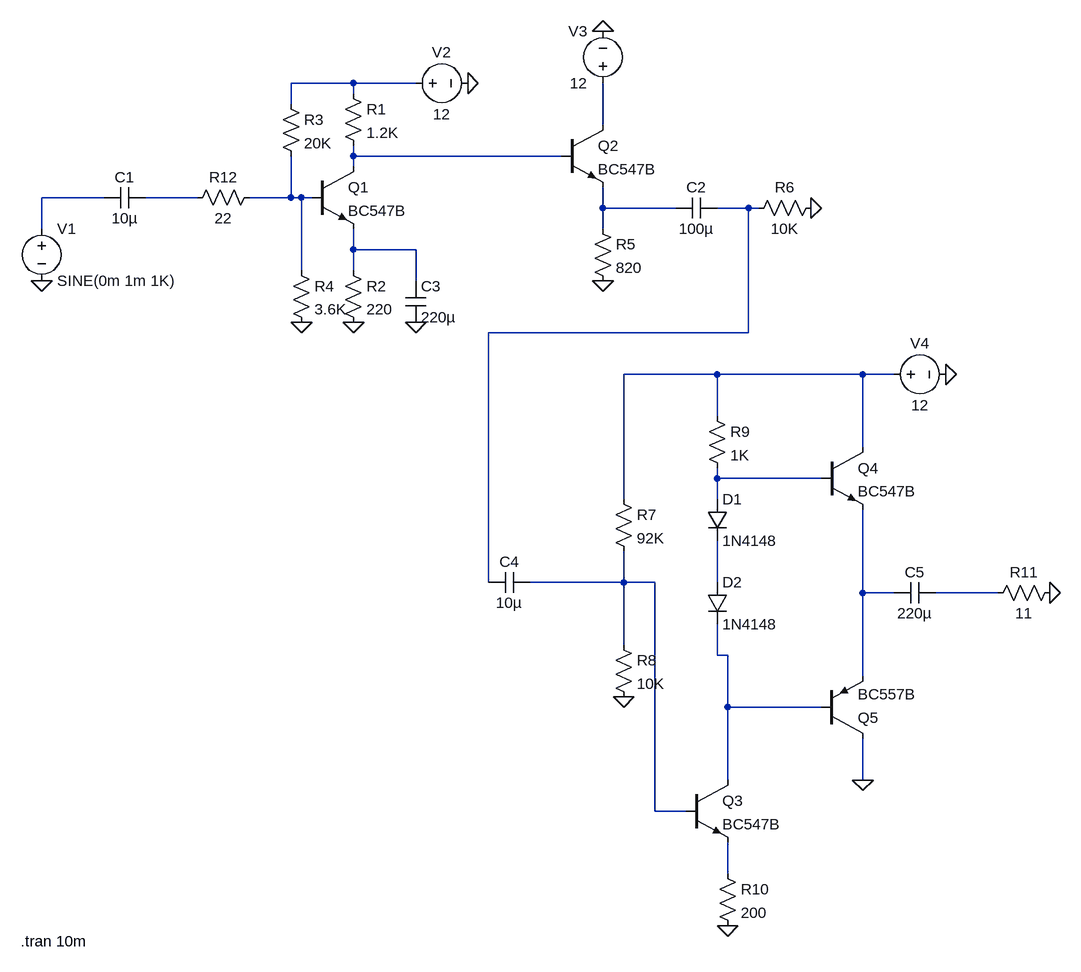
[diagram p0: schematic microphone_amplifier_with_classAB_driver.asc]
microphone_amplifier_with_classAB_driver.asc, the LTspice schematic file:
Version 4.1
SHEET 1 1316 1304
WIRE 224 -32 128 -32
WIRE 320 -32 224 -32
WIRE 224 -16 224 -32
WIRE 128 0 128 -32
WIRE 608 32 608 -32
WIRE 224 80 224 64
WIRE 544 80 224 80
WIRE 224 96 224 80
WIRE -160 144 -256 144
WIRE -16 144 -96 144
WIRE 128 144 128 80
WIRE 128 144 64 144
WIRE 144 144 128 144
WIRE 160 144 144 144
WIRE 608 160 608 128
WIRE 720 160 608 160
WIRE 832 160 784 160
WIRE 848 160 832 160
WIRE -256 192 -256 144
WIRE 608 192 608 160
WIRE 224 224 224 192
WIRE 320 224 224 224
WIRE 144 256 144 144
WIRE 224 256 224 224
WIRE 320 272 320 224
WIRE 832 352 832 160
WIRE 832 352 432 352
WIRE 784 416 640 416
WIRE 1008 416 784 416
WIRE 1056 416 1008 416
WIRE 784 480 784 416
WIRE 1008 528 1008 416
WIRE 784 576 784 560
WIRE 944 576 784 576
WIRE 640 608 640 416
WIRE 784 608 784 576
WIRE 432 736 432 352
WIRE 640 736 640 688
WIRE 640 736 496 736
WIRE 688 736 640 736
WIRE 784 736 784 672
WIRE 1008 752 1008 624
WIRE 1056 752 1008 752
WIRE 1216 752 1120 752
WIRE 640 832 640 736
WIRE 784 848 784 800
WIRE 800 848 784 848
WIRE 1008 880 1008 752
WIRE 800 928 800 848
WIRE 944 928 800 928
WIRE 800 1040 800 928
WIRE 1008 1040 1008 976
WIRE 688 1088 688 736
WIRE 736 1088 688 1088
WIRE 800 1184 800 1136
FLAG 400 -32 0
FLAG 144 336 0
FLAG 224 336 0
FLAG 320 336 0
FLAG 608 -112 0
FLAG 608 272 0
FLAG 928 160 0
FLAG 640 912 0
FLAG 800 1264 0
FLAG 1296 752 0
FLAG 1008 1040 0
FLAG 1136 416 0
FLAG -256 272 0
SYMBOL npn 160 96 R0
SYMATTR InstName Q1
SYMATTR Value BC547B
SYMBOL res 208 -32 R0
SYMATTR InstName R1
SYMATTR Value 1.2K
SYMBOL res 208 240 R0
SYMATTR InstName R2
SYMATTR Value 220
SYMBOL res 112 -16 R0
SYMATTR InstName R3
SYMATTR Value 20K
SYMBOL res 128 240 R0
SYMATTR InstName R4
SYMATTR Value 3.6K
SYMBOL voltage 304 -32 R270
WINDOW 0 32 56 VTop 2
WINDOW 3 -32 56 VBottom 2
WINDOW 123 0 0 Left 0
WINDOW 39 0 0 Left 0
SYMATTR InstName V2
SYMATTR Value 12
SYMBOL cap 304 272 R0
SYMATTR InstName C3
SYMATTR Value 220µ
SYMBOL npn 544 32 R0
SYMATTR InstName Q2
SYMATTR Value BC547B
SYMBOL voltage 608 -16 R180
WINDOW 0 24 96 Left 2
WINDOW 3 24 16 Left 2
WINDOW 123 0 0 Left 0
WINDOW 39 0 0 Left 0
SYMATTR InstName V3
SYMATTR Value 12
SYMBOL res 592 176 R0
SYMATTR InstName R5
SYMATTR Value 820
SYMBOL cap 784 144 R90
WINDOW 0 0 32 VBottom 2
WINDOW 3 32 32 VTop 2
SYMATTR InstName C2
SYMATTR Value 100µ
SYMBOL res 944 144 R90
WINDOW 0 0 56 VBottom 2
WINDOW 3 32 56 VTop 2
SYMATTR InstName R6
SYMATTR Value 10K
SYMBOL cap 496 720 R90
WINDOW 0 0 32 VBottom 2
WINDOW 3 32 32 VTop 2
SYMATTR InstName C4
SYMATTR Value 10µ
SYMBOL res 624 592 R0
SYMATTR InstName R7
SYMATTR Value 92K
SYMBOL res 624 816 R0
SYMATTR InstName R8
SYMATTR Value 10K
SYMBOL res 768 464 R0
SYMATTR InstName R9
SYMATTR Value 1K
SYMBOL diode 768 608 R0
SYMATTR InstName D1
SYMATTR Value 1N4148
SYMBOL diode 768 736 R0
SYMATTR InstName D2
SYMATTR Value 1N4148
SYMBOL npn 736 1040 R0
SYMATTR InstName Q3
SYMATTR Value BC547B
SYMBOL res 784 1168 R0
SYMATTR InstName R10
SYMATTR Value 200
SYMBOL npn 944 528 R0
SYMATTR InstName Q4
SYMATTR Value BC547B
SYMBOL pnp 944 976 M180
SYMATTR InstName Q5
SYMATTR Value BC557B
SYMBOL cap 1120 736 R90
WINDOW 0 0 32 VBottom 2
WINDOW 3 32 32 VTop 2
SYMATTR InstName C5
SYMATTR Value 220µ
SYMBOL res 1312 736 R90
WINDOW 0 0 56 VBottom 2
WINDOW 3 32 56 VTop 2
SYMATTR InstName R11
SYMATTR Value 11
SYMBOL voltage 1040 416 R270
WINDOW 0 32 56 VTop 2
WINDOW 3 -32 56 VBottom 2
WINDOW 123 0 0 Left 0
WINDOW 39 0 0 Left 0
SYMATTR InstName V4
SYMATTR Value 12
SYMBOL res 80 128 R90
WINDOW 0 0 56 VBottom 2
WINDOW 3 32 56 VTop 2
SYMATTR InstName R12
SYMATTR Value 22
SYMBOL cap -96 128 R90
WINDOW 0 0 32 VBottom 2
WINDOW 3 32 32 VTop 2
SYMATTR InstName C1
SYMATTR Value 10µ
SYMBOL voltage -256 176 R0
WINDOW 123 0 0 Left 0
WINDOW 39 0 0 Left 0
SYMATTR InstName V1
SYMATTR Value SINE(0m 1m 1K)
TEXT -288 1288 Left 2 !.tran 10m

The netlist it stands for:
* microphone_amplifier_with_classAB_driver.asc
Q1 N003 N006 N009 0 BC547B
R1 N001 N003 1.2K
R2 N009 0 220
R3 N001 N006 20K
R4 N006 0 3.6K
V2 N001 0 12
C3 N009 0 220µ
Q2 N002 N003 N007 0 BC547B
V3 N002 0 12
R5 N007 0 820
C2 N008 N007 100µ
R6 0 N008 10K
C4 N012 N008 10µ
R7 N010 N012 92K
R8 N012 0 10K
R9 N010 N011 1K
D1 N011 N013 1N4148
D2 N013 N016 1N4148
Q3 N016 N012 N017 0 BC547B
R10 N017 0 200
Q4 N010 N011 N014 0 BC547B
Q5 0 N016 N014 0 BC557B
C5 N015 N014 220µ
R11 0 N015 11
V4 N010 0 12
R12 N006 N005 22
C1 N005 N004 10µ
V1 N004 0 SINE(0m 1m 1K)
.model D D
.lib standard.dio
.model NPN NPN
.model PNP PNP
.lib standard.bjt
.tran 10m
.backanno
.end